# EasyEDA Pro project 带通滤波器（JLC).epro

# Schematic Schematic2
Board Name: Board2; Create Date: 2024-12-09; Page Name: P1; Project Name: microphone_lichaoyuan_202306010309_V1.0; Schematic Name: Schematic2; Update Date: 2024-12-09; Company: 嘉立创EDA; Page Size: A4; Version: V1.0
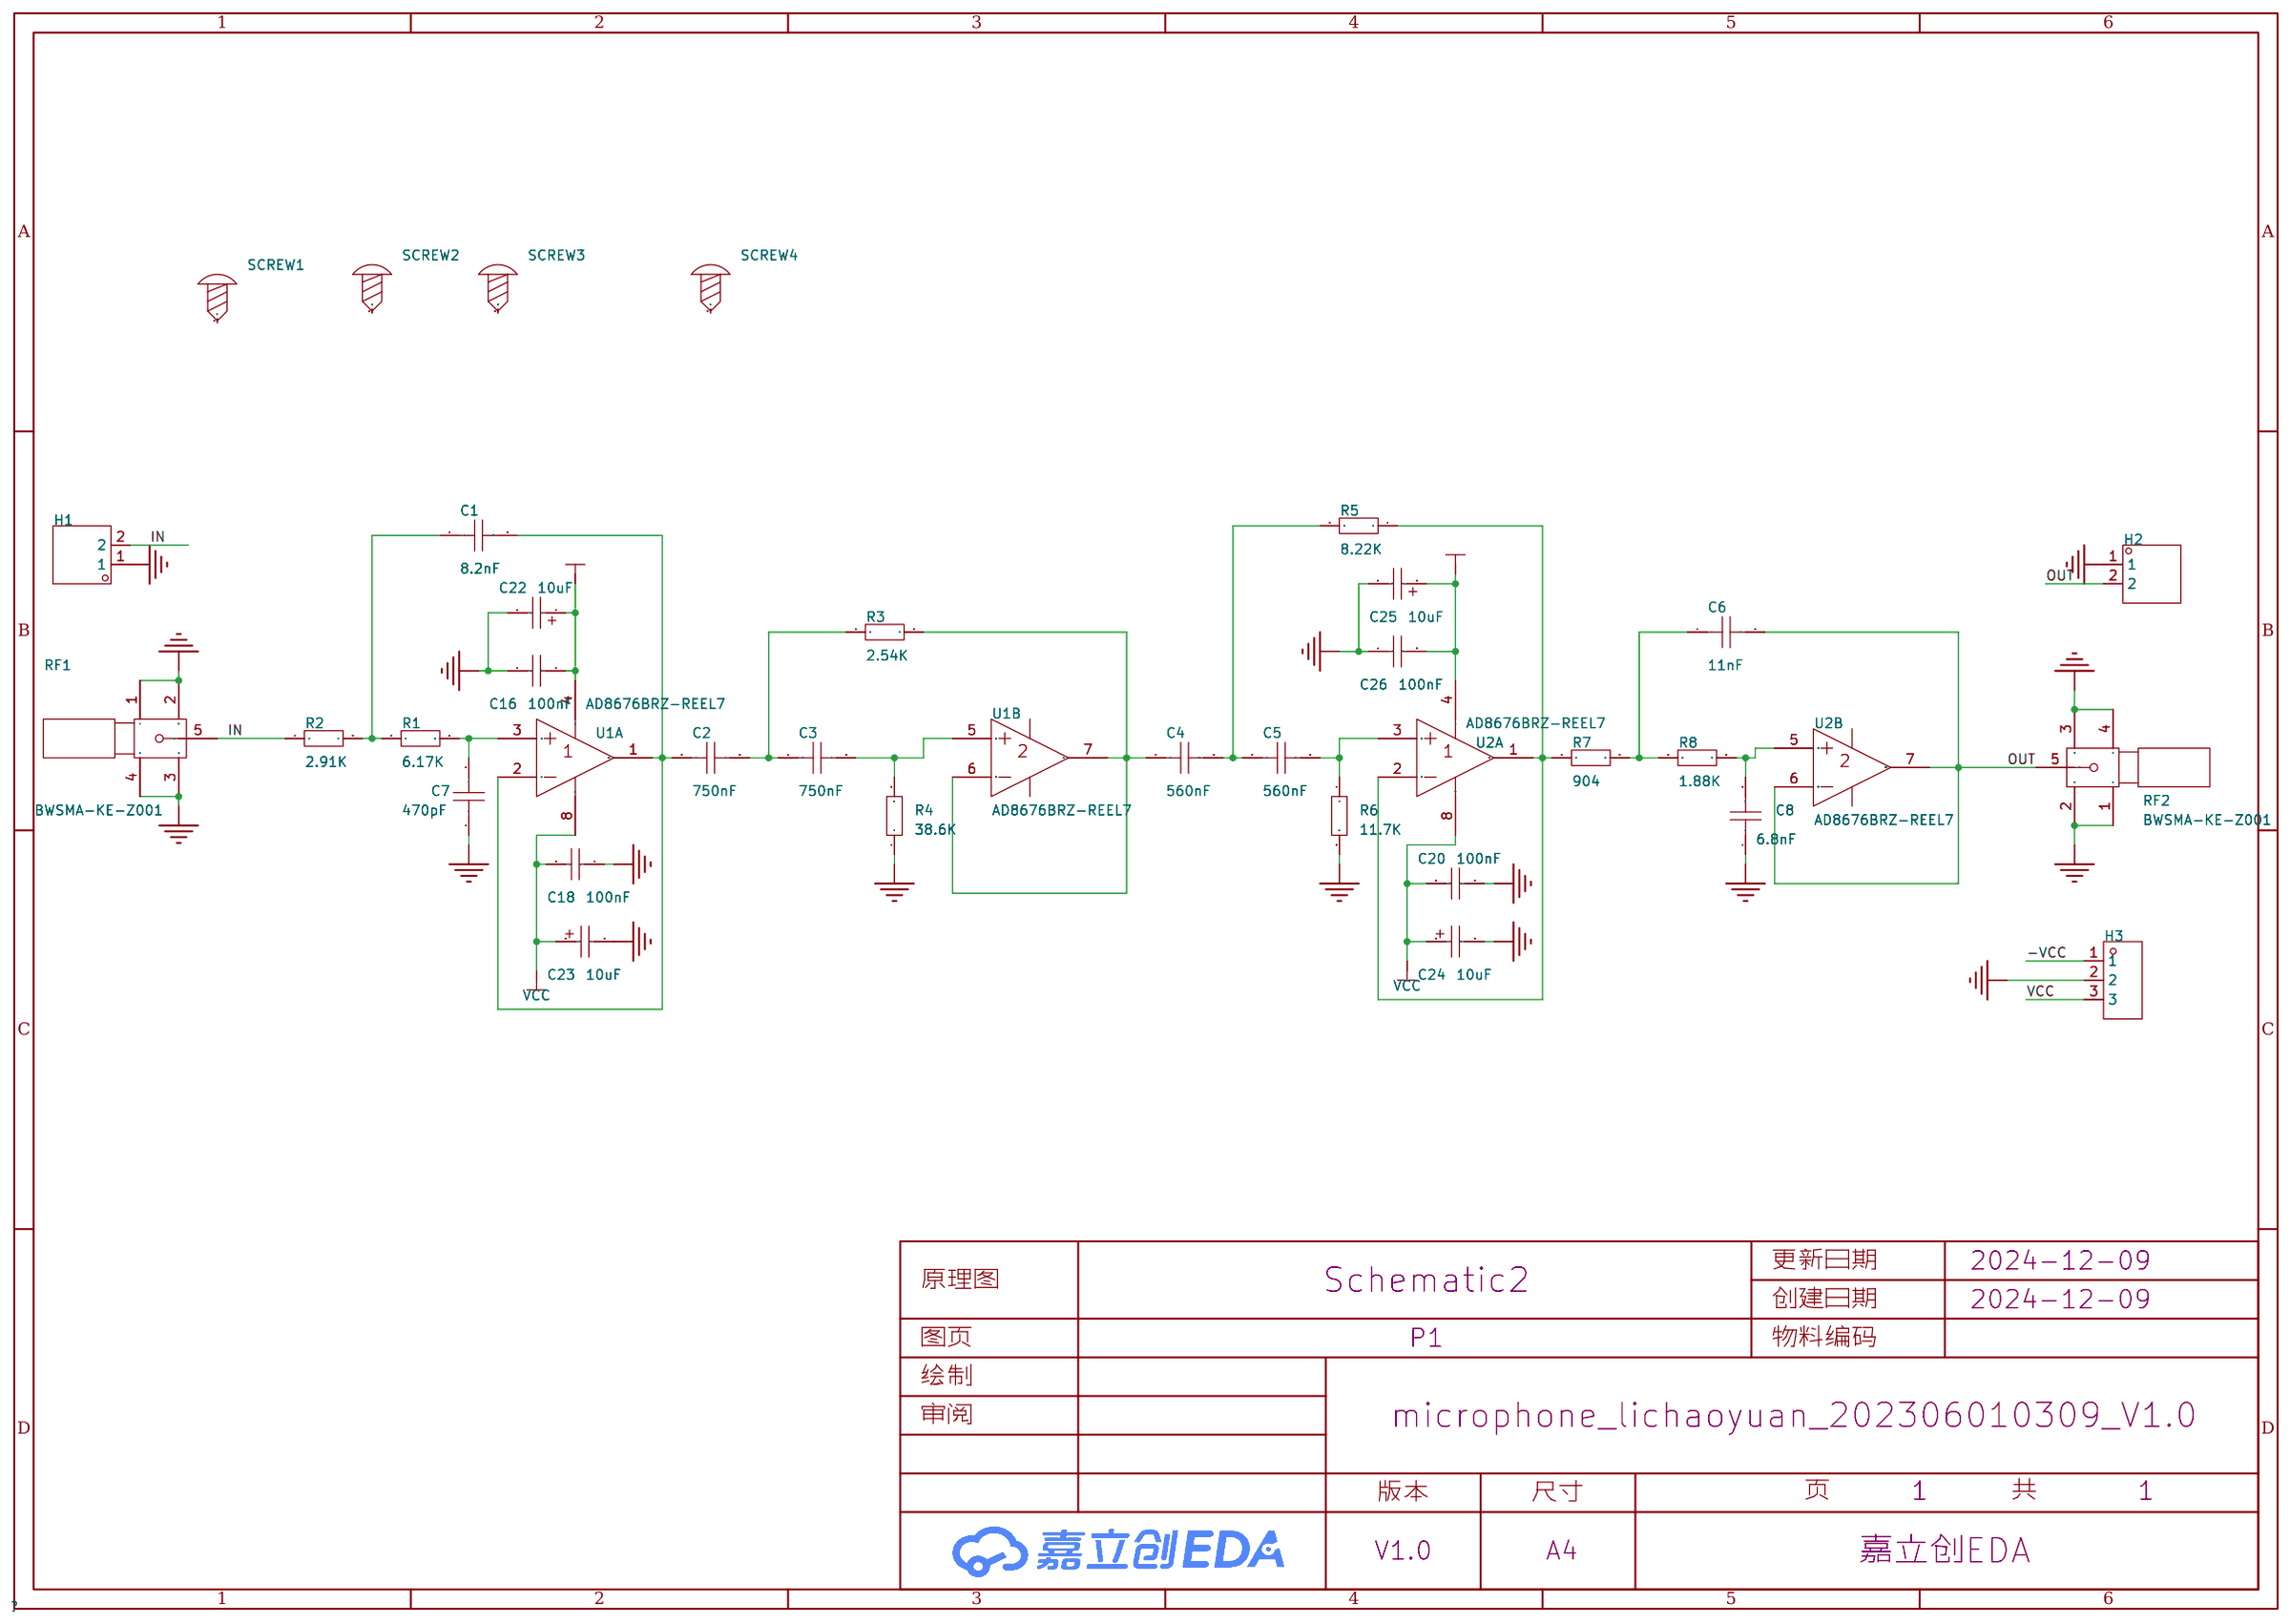
[diagram p0: schematic sheet]

## Parts
C1  8.2nF  [C0603]
C2  750nF  [C0603]
C3  750nF  [C0603]
C4  560nF  [C0603]
C5  560nF  [C0603]
C6  11nF  [C0603]
C7  470pF  [C0603]
C8  6.8nF  [C0603]
C16  100nF  [C0805]
C18  100nF  [C0805]
C20  100nF  [C0805]
C22  10uF  [C_Ele_SMD_5x5.4mm]
C23  10uF  [C_Ele_SMD_5x5.4mm]
C24  10uF  [C_Ele_SMD_5x5.4mm]
C25  10uF  [C_Ele_SMD_5x5.4mm]
C26  100nF  [C0805]
H1  -  [HDR-TH_2P-P2.54-V-M-1]
H2  -  [HDR-TH_2P-P2.54-V-M-1]
H3  -  [HDR-TH_3P-P2.54-V-F]
R1  6.17K  [R0603]
R2  2.91K  [R0603]
R3  2.54K  [R0603]
R4  38.6K  [R0603]
R5  8.22K  [R0603]
R6  11.7K  [R0603]
R7  904  [R0603]
R8  1.88K  [R0603]
RF1  BWSMA-KE-Z001  [SMA-TH_BWSMA-KE-Z001]
RF2  BWSMA-KE-Z001  [SMA-TH_BWSMA-KE-Z001]
SCREW1  -  [M2螺丝]
SCREW2  -  [M2螺丝]
SCREW3  -  [M2螺丝]
SCREW4  -  [M2螺丝]
U1  AD8676BRZ-REEL7  [SOIC-8_L4.9-W3.9-P1.27-LS6.0-BL]  (sections 1,2)
U2  AD8676BRZ-REEL7  [SOIC-8_L4.9-W3.9-P1.27-LS6.0-BL]  (sections 1,2)

## Library data of the parts
C1-C8 = CAP_0603: Supplier Footprint: 0603
C16 C18 C20 C26 = 0805B104J500NT: 容值:100nF;精度:±5%;额定电压:50V;材质(温度系数):X7R;; LCSC Part Name: 100nF ±5% 50V; Supplier Part: C29926; Manufacturer: FH(风华); Supplier Footprint: 0805; JLCPCB Part Class: 扩展库; Datasheet: https://atta.szlcsc.com/upload/public/pdf/source/20200305/C486355_26A10D38EF8C2A5C37091D0039909270.pdf; Supplier: LCSC; Tolerance: ±5%; Voltage Rated: 50V; Temperature Coefficient: X7R
C22-C25 = C_Ele_SMD_5x5.4mm: Supplier Footprint: SMD,5x5.4mm
H1 H2 = HDR-M_2.54_1x2P: Supplier Part: C124375; Supplier Footprint: 插件
H3 = HDR-F_2.54_1x3P: Supplier Part: C541850; Supplier Footprint: 插件
R1-R8 = Res_0603: Supplier Footprint: 0603
RF1 RF2 = BWSMA-KE-Z001_C496549: 连接器类型:板端;接口类型:内孔;端口数量:1;接口直径:-;接口长度/高度:-;频率-最大值:-;射频系列:SMA;阻抗:50Ω;样式:正脚;触头材质:-;触头镀层:-;工作温度范围:-65℃~+165℃;焊接温度(最大值):-;; LCSC Part Name: 内孔 SMA 正脚; Supplier Part: C496549; Manufacturer: BAT WIRELESS(蝙蝠无线); Supplier Footprint: 插件; JLCPCB Part Class: 扩展库; Datasheet: https://atta.szlcsc.com/upload/public/pdf/source/20221228/40BF41E56A06003A0210E1785CA66EA6.pdf; Supplier: LCSC; Connector Type: 板端; Interface Type: 内孔; Number of Ports: 1; RF Series: SMA; Impedance: 50Ω; Style: 正脚; Operating Temperature Range: -65℃~+165℃
SCREW1-SCREW4 = M2螺丝: Supplier Footprint: 插件
U1 U2 = AD8676BRZ-REEL7: 超高精度、36 V、2.8 nV/√Hz双路RRO运算放大器; LCSC Part Name: 超精密，36 V，2.8 nV/√Hz 双轨至轨输出运放; Supplier Part: C578815; Manufacturer: ADI(亚德诺); Supplier Footprint: SOIC-8; JLCPCB Part Class: 扩展库; Datasheet: https://atta.szlcsc.com/upload/public/pdf/source/20200604/C578054_FBAF795188F271D03EE37F8804AA31DB.pdf; Supplier: LCSC

## Nets
-VCC: C16.2 C22.1 C25.1 C26.2 H3.1 U1.4(V-) U2.4(V-)
GND: C7.1 C8.1 C16.1 C18.1 C20.1 C22.2 C23.2 C24.2 C25.2 C26.1 H1.1 H2.1 H3.2 R4.1 R6.2 RF1.1 RF1.2 RF1.3 RF1.4 RF2.1 RF2.2 RF2.3 RF2.4
VCC: C18.2 C20.2 C23.1 C24.1 H3.3 U1.8(V+) U2.8(V+)
IN: H1.2 R2.1 RF1.5
OUT: C6.2 H2.2 RF2.5 U2.6(INB-) U2.7(OUTB)
$1N409: C1.1 R1.1 R2.2
$1N413: C7.2 R1.2 U1.3(INA+)
$1N609: C1.2 C2.1 U1.1(OUTA) U1.2(INA-)
$1N629: C3.2 R4.2 U1.5(INB+)
$1N646: C2.2 C3.1 R3.1
$1N661: C4.1 R3.2 U1.6(INB-) U1.7(OUTB)
$1N677: C4.2 C5.1 R5.2
$1N681: C5.2 R6.1 U2.3(INA+)
$1N721: R5.1 R7.1 U2.1(OUTA) U2.2(INA-)
$1N737: C8.2 R8.2 U2.5(INB+)
$1N743: C6.1 R7.2 R8.1

Not connected (* = marked no-connect by the designer): SCREW1 1; SCREW2 1; SCREW3 1; SCREW4 1

# Board PCB2
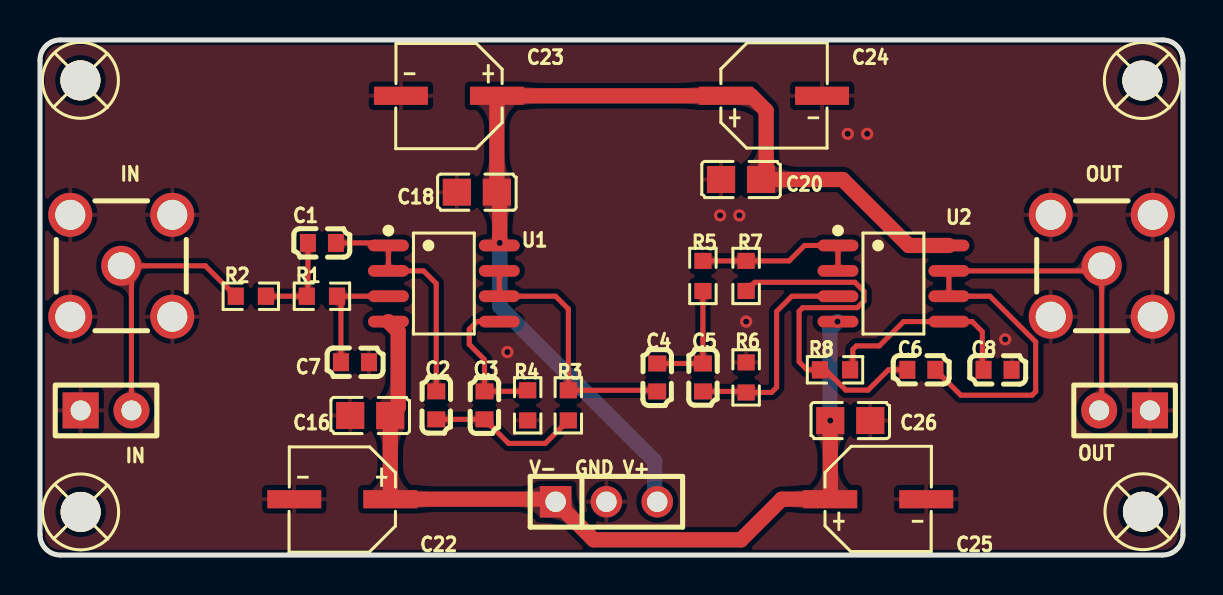
[diagram p1: board, top side]
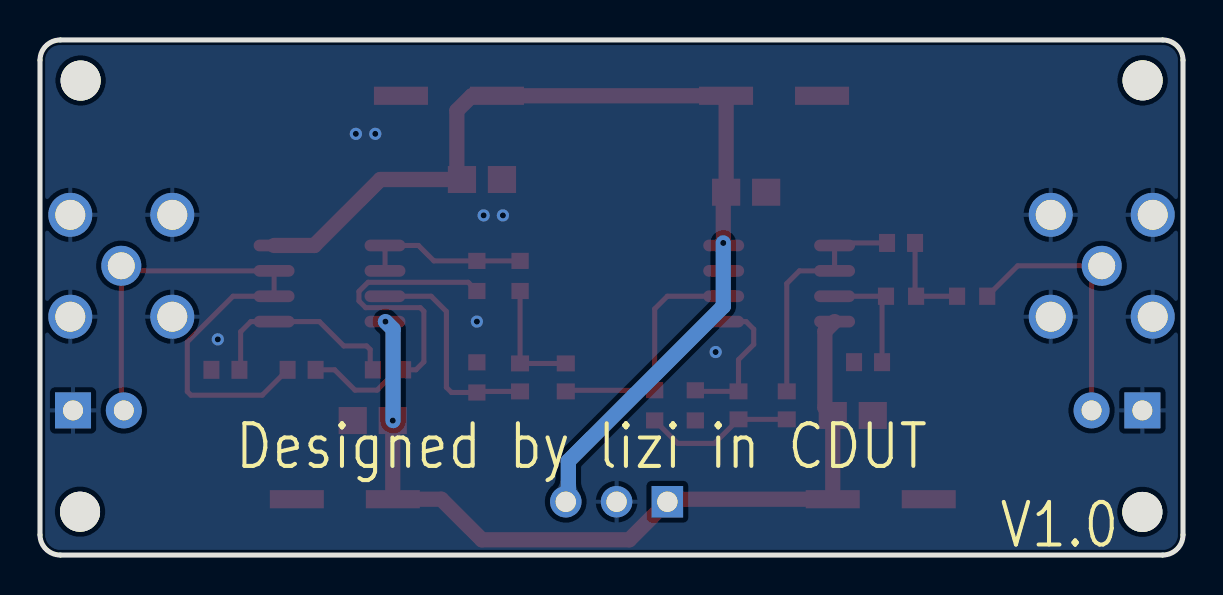
[diagram p2: board, bottom side, seen from below]

Outline 57.15 x 25.78 mm; copper layers: Top Layer, Bottom Layer. Coordinates in mm from the lower left corner of the outline.
Outline path: 0,24.77 0,1.02 arc(0.3,0.3) 1.02,0 56.13,0 arc(56.85,0.3) 57.15,1.02 57.15,24.77 arc(56.85,25.48) 56.13,25.78 1.02,25.78 arc(0.3,25.48) 0,24.77
Stack: Top Layer 0.035mm / Dielectric1 1.51mm FR4 er 4.5 / Bottom Layer 0.035mm

## Design rules (mm)
template: JLCPCB Capability(Two Layers Board)
spacing copperThickness1oz (default): track to track 0.102, other pairs 0.152 to 0.3
spacing copperThickness2oz: track to track 0.203, other pairs 0.152 to 0.3
track width copperThickness1oz (default): min 0.127, default 0.254, max 2.54
track width copperThickness2oz: min 0.203, default 0.254, max 2.54
differential pair differentialPair (default): width min 0.127, default 0.254, max 2.54; gap min 0.152, default 0.152
via viaSize (default): diameter min 0.5, default 0.61, max 10; hole min 0.3, default 0.305, max 6.3

## Placement (name value [footprint] x y rotation side)
C1  8.2nF  [C0603]  14.1 15.62 0 top
C2  750nF  [C0603]  19.81 7.49 270 top
C3  750nF  [C0603]  22.22 7.49 90 top
C4  560nF  [C0603]  30.86 8.89 90 top
C5  560nF  [C0603]  33.15 8.89 270 top
C6  11nF  [C0603]  44.07 9.27 0 top
C7  470pF  [C0603]  15.75 9.65 180 top
C8  6.8nF  [C0603]  47.88 9.27 180 top
C16  100nF  [C0805]  16.51 6.98 0 top
C18  100nF  [C0805]  21.84 18.16 0 top
C20  100nF  [C0805]  35.05 18.8 0 top
C22  10uF  [C_Ele_SMD_5x5.4mm]  15.11 2.79 180 top
C23  10uF  [C_Ele_SMD_5x5.4mm]  20.45 22.99 180 top
C24  10uF  [C_Ele_SMD_5x5.4mm]  36.7 22.99 0 top
C25  10uF  [C_Ele_SMD_5x5.4mm]  41.91 2.79 0 top
C26  100nF  [C0805]  40.51 6.73 180 top
IN  -  [HDR-TH_2P-P2.54-V-M-1]  3.3 7.24 0 top
IN#2  -  [SMA-TH_BWSMA-KE-Z001]  4.06 14.48 0 top
OUT  -  [HDR-TH_2P-P2.54-V-M-1]  54.23 7.24 180 top
OUT#2  -  [SMA-TH_BWSMA-KE-Z001]  53.09 14.48 0 top
R1  6.17K  [R0603]  14.1 12.95 0 top
R2  2.91K  [R0603]  10.54 12.95 0 top
R3  2.54K  [R0603]  26.42 7.49 90 top
R4  38.6K  [R0603]  24.38 7.49 90 top
R5  8.22K  [R0603]  33.15 13.97 270 top
R6  11.7K  [R0603]  35.31 8.89 90 top
R7  904  [R0603]  35.31 13.97 270 top
R8  1.88K  [R0603]  39.75 9.27 0 top
SCREW1  -  [M2螺丝]  2.02 23.76 0 top
SCREW2  -  [M2螺丝]  2.03 2.16 0 top
SCREW3  -  [M2螺丝]  55.12 23.75 0 top
SCREW4  -  [M2螺丝]  55.15 2.17 0 top
U1  AD8676BRZ-REEL7  [SOIC-8_L4.9-W3.9-P1.27-LS6.0-BL]  20.19 13.59 270 top
U2  AD8676BRZ-REEL7  [SOIC-8_L4.9-W3.9-P1.27-LS6.0-BL]  42.67 13.59 270 top
V-  GND V+  -  [HDR-TH_3P-P2.54-V-F]  28.32 2.67 0 top

## Footprints (pads in the part's own frame, mm; a bottom-side part is the same pattern mirrored in y, then rotated)
C0603
  rect 0.8x0.9 smd: 1(-0.7,0) 2(0.7,0)
C0805
  rect 1.41x1.35 smd: 1(-1,0) 2(1,0)
C_Ele_SMD_5x5.4mm
  rect 2.7x0.91 smd: 1(-2.4,0) 2(2.4,0)
HDR-TH_2P-P2.54-V-M-1
  rect 1.8x1.8 hole 1: 1(-1.27,0)
  round 1.8 hole 1: 2(1.27,0)
HDR-TH_3P-P2.54-V-F
  rect 1.575x1.575 hole 1.02: 1(-2.54,0)
  round 1.575 hole 1.02: 2(0,0) 3(2.54,0)
M2螺丝
  round 2 hole 2: 1(0,0)
R0603
  rect 0.806x0.864 smd: 1(-0.753,0) 2(0.753,0)
SMA-TH_BWSMA-KE-Z001
  round 2.2 hole 1.5: 1(-2.55,-2.55) 2(-2.55,2.55) 3(2.55,2.55) 4(2.55,-2.55)
  round 2 hole 1.35: 5(0,0)
SOIC-8_L4.9-W3.9-P1.27-LS6.0-BL
  oval 0.588x2.045 smd: 1(-1.905,-2.772) 2(-0.635,-2.772) 3(0.635,-2.772) 4(1.905,-2.772) 5(1.905,2.772) 6(0.635,2.772) 7(-0.635,2.772) 8(-1.905,2.772)

## Nets
-VCC: C16.2 C22.1 C25.1 C26.2 U1.4 U2.4 V-  GND V+.1
GND: C7.1 C8.1 C16.1 C18.1 C20.1 C22.2 C23.2 C24.2 C25.2 C26.1 IN.1 IN#2.1 IN#2.2 IN#2.3 IN#2.4 OUT.1 OUT#2.1 OUT#2.2 OUT#2.3 OUT#2.4 R4.1 R6.2 V-  GND V+.2
VCC: C18.2 C20.2 C23.1 C24.1 U1.8 U2.8 V-  GND V+.3
IN: IN.2 IN#2.5 R2.1
OUT: C6.2 OUT.2 OUT#2.5 U2.6 U2.7
$1N409: C1.1 R1.1 R2.2
$1N413: C7.2 R1.2 U1.3
$1N609: C1.2 C2.1 U1.1 U1.2
$1N629: C3.2 R4.2 U1.5
$1N646: C2.2 C3.1 R3.1
$1N661: C4.1 R3.2 U1.6 U1.7
$1N677: C4.2 C5.1 R5.2
$1N681: C5.2 R6.1 U2.3
$1N721: R5.1 R7.1 U2.1 U2.2
$1N737: C8.2 R8.2 U2.5
$1N743: C6.1 R7.2 R8.1

Pads without a net: SCREW1 1; SCREW2 1; SCREW3 1; SCREW4 1

## Via types
v1: diameter 0.61, hole 0.305, Top Layer to Bottom Layer, 10 vias

## Routing (per net, layer and track width the routed paths; a pad name or vN(x,y) marks a point on that pad's centre or on a via; arc(x,y) is an arc through that point)
-VCC: length 41.9
  Top Layer w0.762: v1(39.51,6.73) 39.51,2.8 C25.1 37.08,2.79 35.05,0.76 27.69,0.76 V-  GND V+.1 ; 25.78,2.79 C22.1 17.51,6.98 C16.2 17.91,7.38 17.91,11.2 U1.4
  Bottom Layer w0.762: 39.5,6.73 39.5,11.3 v1(39.88,11.68)
GND:
  vias: v1(23.37,10.16) v1(34,17) v1(34.97,17) v1(35.31,11.68) v1(40.39,21.08) v1(41.36,21.08) v1(48.26,10.79)
VCC: length 51.7
  Top Layer w0.762: U2.8 43.43,15.49 40.13,18.8 C20.2 36.31,19.05 36.31,22.24 35.56,22.99 C24.1 C23.1 22.84,22.98 C18.2 22.99,18.02 v1(22.99,15.62)
  Bottom Layer w0.762: V-  GND V+.3 30.73,2.79 30.73,4.7 22.99,12.45 v1(22.99,15.62)
IN: length 13.8
  Top Layer w0.254: 4.57,7.24 4.57,13.97 IN#2.5 8.26,14.48 R2.1
OUT: length 29.7
  Top Layer w0.254: C6.2 46.04,8 49.6,8 49.78,8.18 49.78,10.67 47.5,12.95 U2.6 U2.7 52.83,14.22 OUT#2.5 53.09,7.37 OUT.2
$1N409: length 4.7
  Top Layer w0.254: C1.1 13.4,13.01 R1.1 R2.2
$1N413: length 6
  Top Layer w0.254: C7.2 15.05,12.76 R1.2 U1.3
$1N609: length 12
  Top Layer w0.254: C2.1 19.81,13.59 19.18,14.22 U1.2 U1.1 17.29,15.62 C1.2
$1N629: length 7.3
  Top Layer w0.254: R4.2 24.33,8.19 C3.2 22.22,9.78 21.46,10.54 21.46,11.3 21.84,11.68 U1.5
$1N646: length 7.6
  Top Layer w0.254: C2.2 C3.1 23.43,5.59 25.26,5.59 R3.1
$1N661: length 13.5
  Top Layer w0.254: C4.1 30.8,8.25 R3.2 26.42,12.32 25.78,12.95 U1.6 U1.7
$1N677: length 5.9
  Top Layer w0.254: R5.2 C5.1 C4.2
$1N681: length 11
  Top Layer w0.254: U2.3 37.59,12.95 36.83,12.19 36.83,8.39 36.58,8.14 R6.1 35.25,8.19 C5.2
$1N721: length 8.3
  Top Layer w0.254: R5.1 R7.1 37.46,14.72 38.23,15.49 U2.1 U2.2
$1N737: length 10.7
  Top Layer w0.254: 40.5,9.14 40.64,9.01 40.64,10.29 40.82,10.47 41.96,10.47 43.18,11.68 U2.5 46.61,11.68 47.12,11.18 47.12,9.33 C8.2
$1N743: length 19.2
  Top Layer w0.254: R7.2 35.74,13.65 40.75,13.65 41.2,13.2 41.2,12.72 40.87,12.38 38.14,12.38 37.96,12.2 37.96,9.67 38.35,9.27 R8.1 39.27,9.27 40.29,8.25 41.4,8.25 42.42,9.27 C6.1

## Copper pours and planes (outline as drawn; the poured copper is in the pictures)
GND on Top Layer: -0.38,26.03 57.4,26.03 57.4,-0.38 -0.38,-0.38
GND on Bottom Layer: -0.76,26.29 58.42,26.29 58.42,-1.4 -0.76,-1.4

Small or netless copper shapes (teardrops, artwork), in the pictures only: 79 on Top Layer, 1 on Bottom Layer

## Text on the board
Bottom Silkscreen Layer: V1.0 | Designed by lizi in CDUT
